# EAGLE design projeto teste (EAGLE 9.5.2)
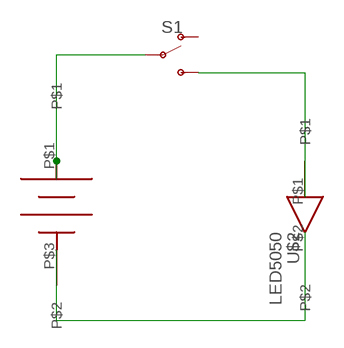
[diagram p0: schematic, sheet 1]

## Parts
S1  SWITCH-SPDT-SMD-RIGHT-ANGLE  [SWITCH_SPST_SMD_A]
U$1  CR2025  [CR2025]
U$2  LED5050  [LED5050]

## Nets
N$1: S1.2(P) U$1.P$1
N$2: S1.3(S) U$2.P$1
N$3: U$1.P$3 U$2.P$2
Unconnected: S1.1(O)

## Library data of the parts
S1 = PatternAgents-ProtoPads:SWITCH-SPDT: Single Pole, Double Throw (SPDT) Switch Single-pole, double-throw (SPDT) switch. Variant Overview SMD-AYZ0202 Surface Mount DPDT Switch <https://www.sparkfun.com/products/597> (COM-00597) Used on e.g. LilyPad Arduino USB - ATmega32U4 Board <https://www.sparkfun.com/products/12049> PTH-11.6X4.0MM SPDT Mini Power Switch <https://www.sparkfun.com/products/102> (COM-00102) Used on e.g. SparkFun Simon Says - Through-Hole Soldering Kit <https://www.sparkfun.com/products/10547> (KIT-10547) PTH-11.6X4.0MM-KIT KIT version of SPDT Mini Power Switch - Simplifies soldering by removing tStop of switch pins - only one side can be soldered. PTH-11.6X4.0MM-LOCK LOCK version of SPDT Mini Power Switch - Offset pins hold switch in place for easier soldering. SMD-RIGHT-ANGLE Surface Mount Right Angle Switch <https://www.sparkfun.com/products/10860> (COM-10860) Used on e.g. SparkFun ESP8266 Thing <https://www.sparkfun.com/products/13231>; PROD_ID: SWCH-10651; SF_SKU: COM-10860
U$1 = supply1:CR2025
U$2 = Eletroblocks Lib:LED5050

## Board
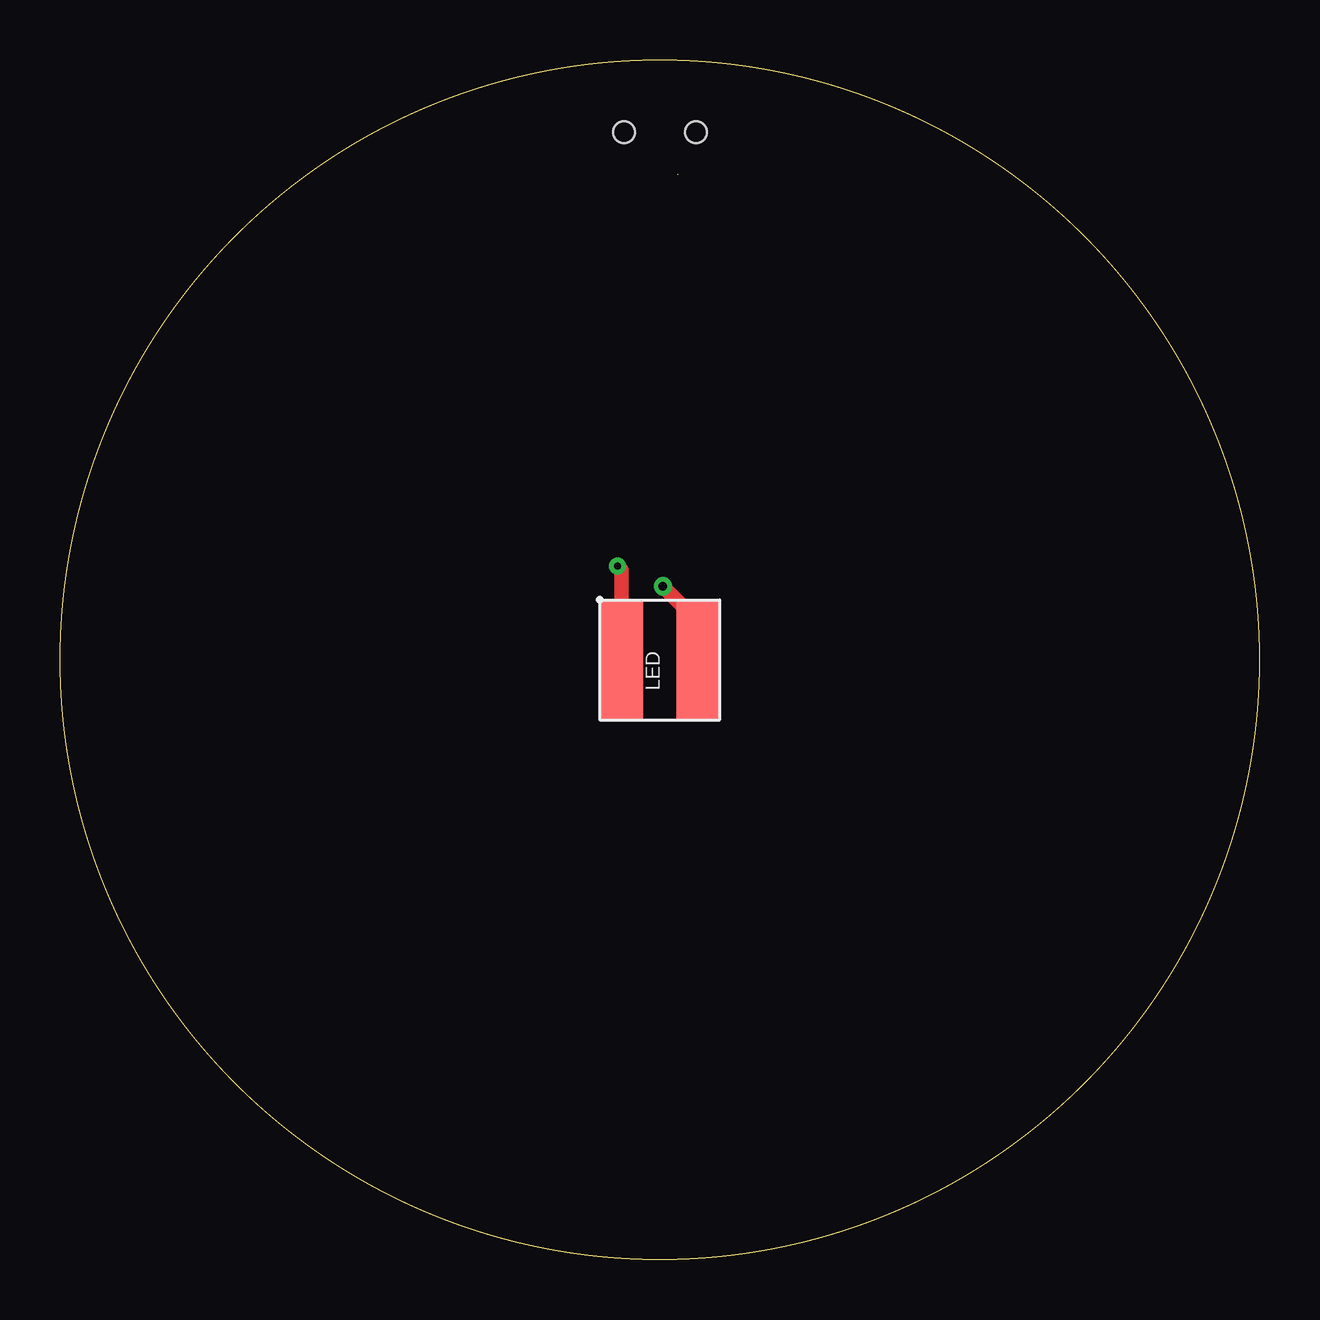
[diagram p1: board, top side]
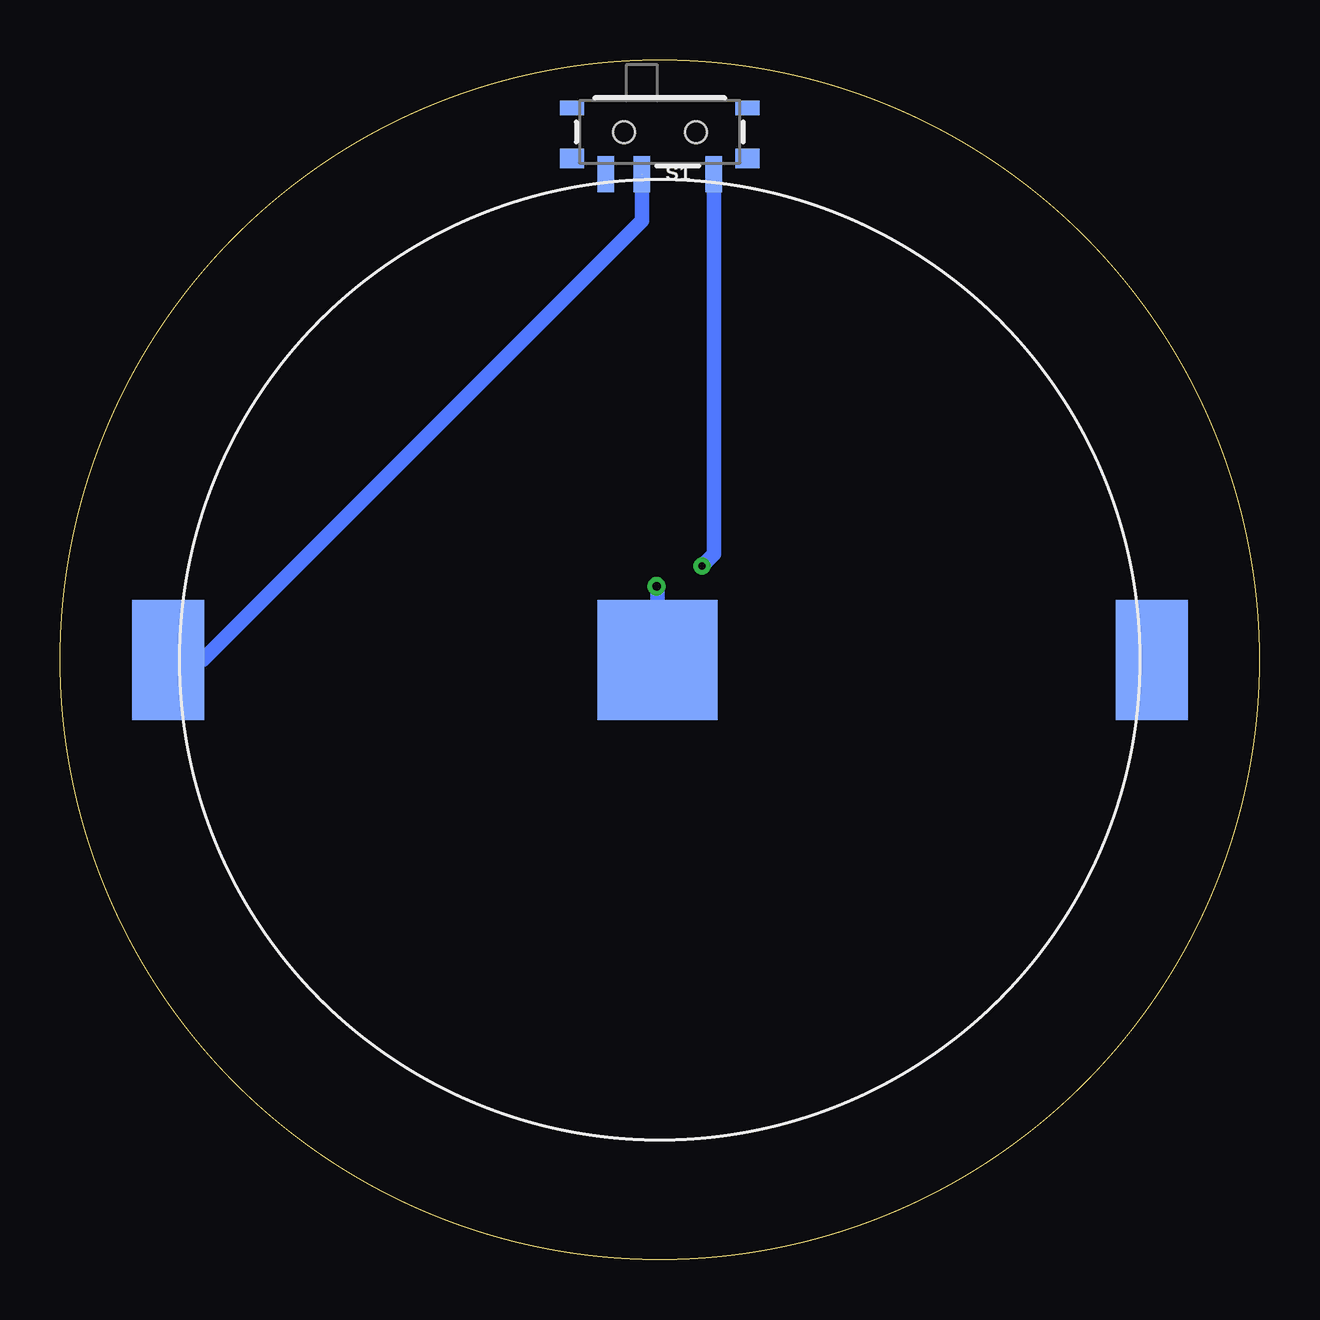
[diagram p2: board, bottom side, seen from below]

Size 50 x 50 mm. Coordinates in mm from the lower left corner, seen from the top.
Outline: circle at 25,25 radius 25
Copper layers (1*16): Top 0.035mm / dielectric 1.5mm / Bottom 0.035mm
Design rules "default": minimum track width 6mil, minimum drill 0.35mm, track to track 6mil, track to pad 6mil, pad to pad 6mil, via to via 6mil, smd to smd 6mil, copper to edge 40mil, drill to drill 6mil, minimum pad ring 10mil, minimum via ring 8mil, stop-mask expansion 4mil, vias tented up to drill 3mm, thermal gap 10mil

### Footprints (pad centres in the part's own frame; a part is rotated, then mirrored left to right if it is on the bottom)
SWITCH_SPST_SMD_A = smd 0.7 x 1.5: 1 -2.25,-1.75; 2 -0.75,-1.75; 3 2.25,-1.75 | smd 1 x 0.6: GND1 -3.65,1; GND3 3.65,1 | smd 1 x 0.8: GND2 -3.65,-1.1; GND4 3.65,-1.1 | hole 0.9: -1.5,0; 1.5,0
CR2025 = smd 3 x 5: P$1 -20.5,0; P$2 20.5,0 | smd 5 x 5: P$3 -0.1,0
LED5050 = smd 1.8 x 5: P$1 -1.6,0; P$2 1.6,0

### Placement (x,y rotation side)
S1  25,47 0 bottom
U$1  25,25 0 bottom
U$2  25,25 0 top

### Tracks (layer width: path | path; a pad name or v marks a point on that pad's centre or on a via)
N$1  (1 unrouted)
  Bottom 0.61: U$1.P$1 44.06,25 25.75,43.31 S1.2
N$2  (via drill 0.3)
  Top 0.61: v23.24,28.91 23.4,28.75 U$2.P$1
  Bottom 0.61: S1.3 22.75,29.4 v23.24,28.91
N$3  (via drill 0.35)
  Top 0.61: v25.13,28.06 26.6,26.59 U$2.P$2
  Bottom 0.61: U$1.P$3 25.1,28.03 v25.13,28.06